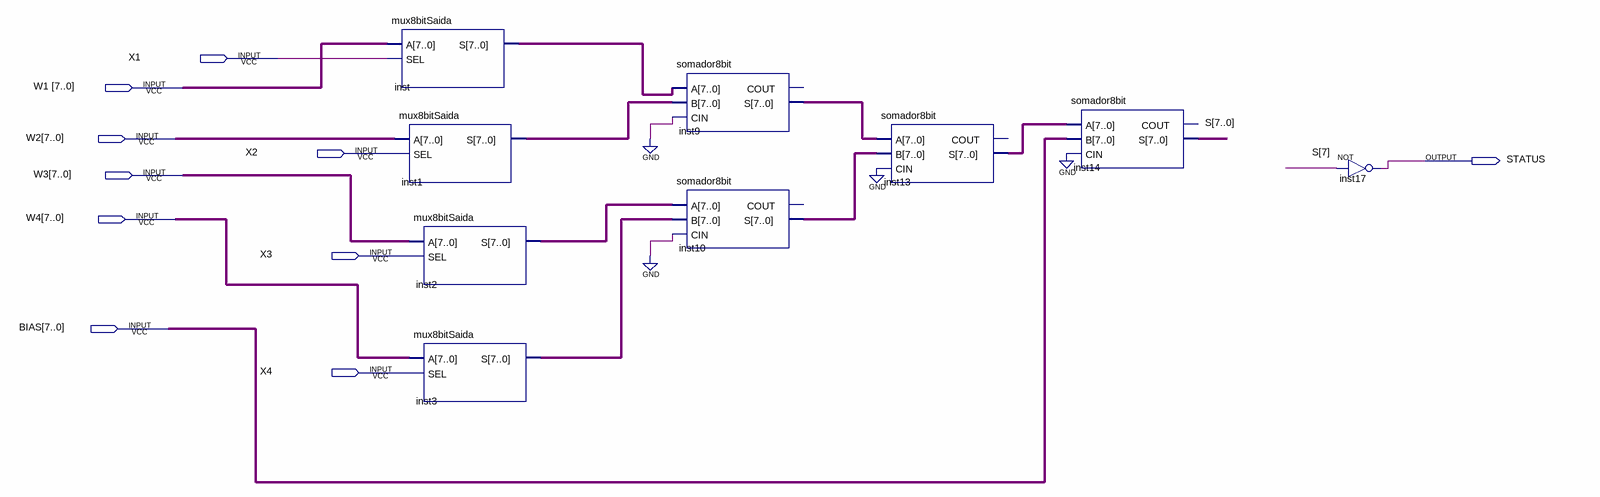
[diagram p0: schematic sheet]
// Quartus schematic NEURON.bdf as structural Verilog: 9 symbols, 10 pins
module NEURON (
  input  X1,
  input  [7:0] W1,
  input  [7:0] W2,
  input  X2,
  input  [7:0] W3,
  input  [7:0] W4,
  input  X3,
  input  [7:0] BIAS,
  input  X4,
  output STATUS
);

  wire [7:0] inst1_s, inst2_s, inst3_s, inst9_s, inst10_s, inst13_s, inst_s, S;

  mux8bitSaida inst (.A(W1), .SEL(X1), .S(inst_s));
  mux8bitSaida inst1 (.A(W2), .SEL(X2), .S(inst1_s));
  mux8bitSaida inst2 (.A(W3), .SEL(X3), .S(inst2_s));
  mux8bitSaida inst3 (.A(W4), .SEL(X4), .S(inst3_s));
  somador8bit inst9 (.A(inst_s), .B(inst1_s), .CIN(1'b0), .S(inst9_s));  // open: COUT
  somador8bit inst10 (.A(inst2_s), .B(inst3_s), .CIN(1'b0), .S(inst10_s));  // open: COUT
  somador8bit inst13 (.A(inst9_s), .B(inst10_s), .CIN(1'b0), .S(inst13_s));  // open: COUT
  somador8bit inst14 (.A(inst13_s), .B(BIAS), .CIN(1'b0), .S(S));  // open: COUT
  not inst17 (STATUS, S[7]);
endmodule
